# Altium project esp8266.PrjPcb
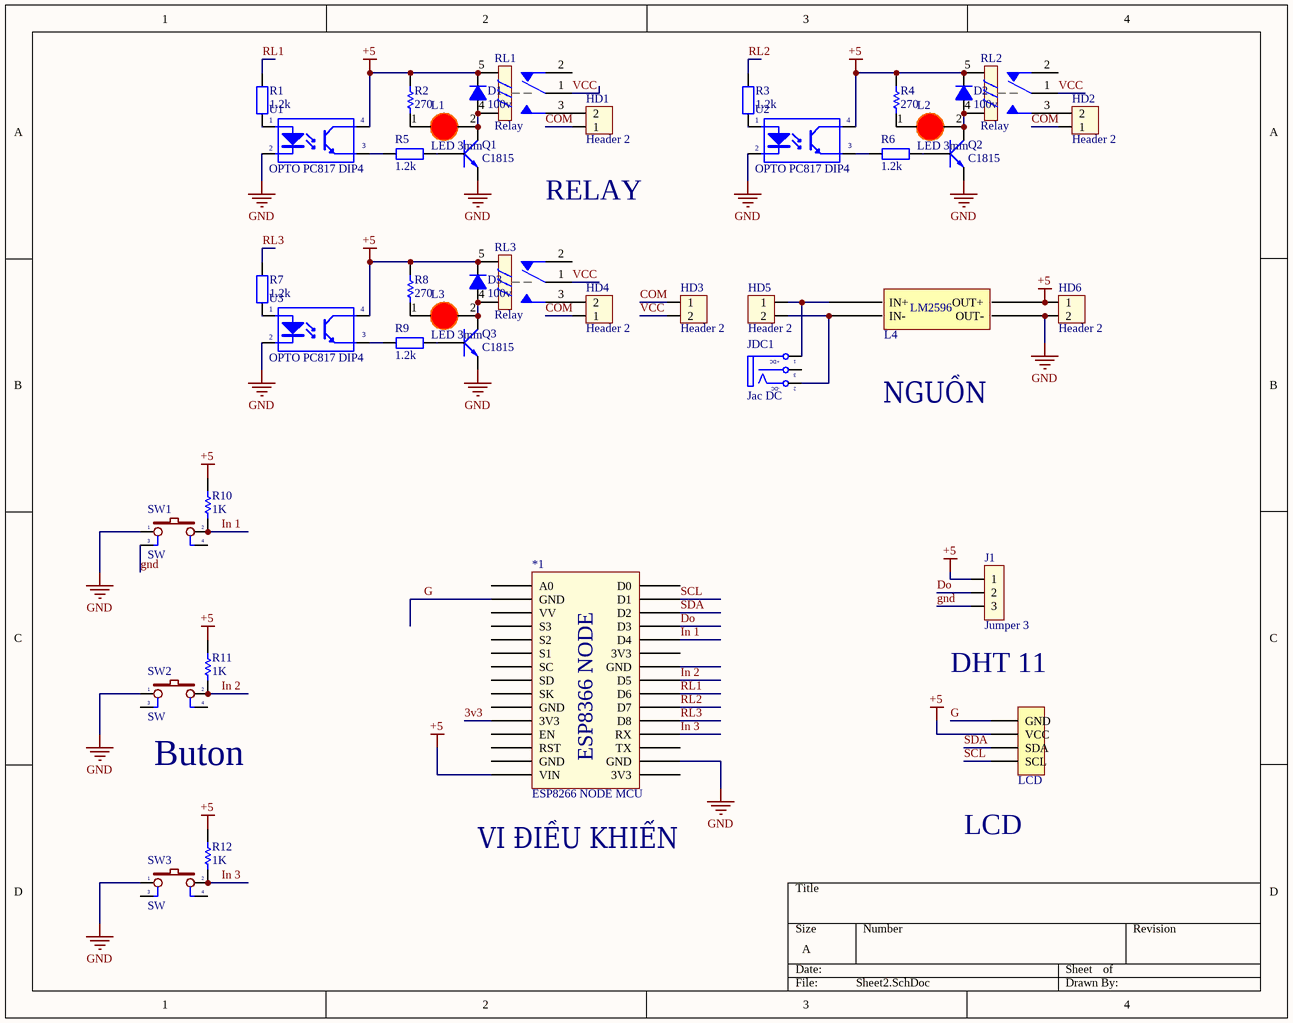
[diagram p0: Sheet2.SchDoc]
1 sheet, 41 parts. Net scope: global (net labels, ports and power ports of the same name join across sheets).
Board file: PCB1.PcbDoc

## Sheet Sheet2.SchDoc
size A

### Parts
*1  ESP8266 NODE MCU  [ESP8266 NODE MCU]
D1  100v  [DIODE 1A]
D2  100v  [DIODE 1A]
D3  100v  [DIODE 1A]
H1  LCD  [XH2.54M-4]
HD1  Header 2  [HED2]
HD2  Header 2  [HED2]
HD3  Header 2  [HED2]
HD4  Header 2  [HED2]
HD5  Header 2  [HED2]
HD6  Header 2  [HED2]
J1  Jumper 3  [JP3]
JDC1  Jac DC  [DC-IN]
L1  LED 3mm  [LED-3MM-RED]
L2  LED 3mm  [LED-3MM-RED]
L3  LED 3mm  [LED-3MM-RED]
L4  BUCK_LM2596  [BUCK_LM2596]  (value not drawn)
Q1  C1815  [TO92]
Q2  C1815  [TO92]
Q3  C1815  [TO92]
R1  1.2k  [tro vach 1/4w]
R2  value 270  [R1/4W1]  (hidden comment: Res1)
R3  1.2k  [tro vach 1/4w]
R4  value 270  [R1/4W1]  (hidden comment: Res1)
R5  1.2k  [tro vach 1/4w]
R6  1.2k  [tro vach 1/4w]
R7  1.2k  [tro vach 1/4w]
R8  value 270  [R1/4W1]  (hidden comment: Res1)
R9  1.2k  [tro vach 1/4w]
R10  value 1K  [R1/4W]  (hidden comment: Res1)
R11  value 1K  [R1/4W]  (hidden comment: Res1)
R12  value 1K  [R1/4W]  (hidden comment: Res1)
RL1  Relay  [Relay 5 Chan SRD]
RL2  Relay  [Relay 5 Chan SRD]
RL3  Relay  [Relay 5 Chan SRD]
SW1  SW  [SW4B]
SW2  SW  [SW4B]
SW3  SW  [SW4B]
U1  OPTO PC817 DIP4  [DIP4]
U2  OPTO PC817 DIP4  [DIP4]
U3  OPTO PC817 DIP4  [DIP4]

### Nets
+5: *1.15(VIN) D1.2(K) D2.2(K) D3.2(K) H1.2(VCC) HD6.1 J1.1 L4.4(OUT+) R2.2 R4.2 R8.2 R10.2 R11.2 R12.2 RL1.5 RL2.5 RL3.5 U1.4(C) U2.4(C) U3.4(C)
gnd: *1.17(GND) HD6.2 J1.3 L4.3(OUT-) Q1.1(E) Q2.1(E) Q3.1(E) SW1.1 SW1.3 SW2.1 SW3.1 U1.2(K) U2.2(K) U3.2(K)
3v3: *1.11(3V3)
COM: HD1.1 HD2.1 HD3.1 HD4.1
Do: *1.27(D3) J1.2
G: *1.2(GND) H1.1(GND)
In 1: *1.26(D4) R10.1 SW1.2
In 2: *1.23(D5) R11.1 SW2.2
In 3: *1.19(RX) R12.1 SW3.2
RL1: *1.22(D6) R1.1
RL2: *1.21(D7) R3.1
RL3: *1.20(D8) R7.1
SCL: *1.29(D1) H1.4(SCL)
SDA: *1.28(D2) H1.3(SDA)
VCC: HD3.2 RL1.1 RL2.1 RL3.1
NetD1_1: D1.1(A) L1.2(K) Q1.2(C) RL1.4
NetD2_1: D2.1(A) L2.2(K) Q2.2(C) RL2.4
NetD3_1: D3.1(A) L3.2(K) Q3.2(C) RL3.4
NetHD1_2: HD1.2 RL1.3
NetHD2_2: HD2.2 RL2.3
NetHD4_2: HD4.2 RL3.3
NetHD5_1: HD5.1 JDC1.1(T) L4.1(IN+)
NetHD5_2: HD5.2 JDC1.2(TN) L4.2(IN-)
NetL1_1: L1.1(A) R2.1
NetL2_1: L2.1(A) R4.1
NetL3_1: L3.1(A) R8.1
NetQ1_3: Q1.3(B) R5.1
NetQ2_3: Q2.3(B) R6.1
NetQ3_3: Q3.3(B) R9.1
NetR1_2: R1.2 U1.1(A)
NetR3_2: R3.2 U2.1(A)
NetR5_2: R5.2 U1.3(E)
NetR6_2: R6.2 U2.3(E)
NetR7_2: R7.2 U3.1(A)
NetR9_2: R9.2 U3.3(E)

Not connected (* = marked no-connect by the designer): *1 1(A0) 3(VV) 4(S3) 5(S2) 6(S1) 7(SC) 8(SD) 9(SK) 10(GND) 12(EN) 13(RST) 14(GND) 16(3V3) 18(TX) 24(GND) 25(3V3) 30(D0); JDC1 3(S); RL1 2; RL2 2; RL3 2; SW1 4; SW2 3 4; SW3 3 4

### Notes on the sheet
- RELAY
- NGUỒN
- DHT 11
- (near SW2) Buton
- (near H1) LCD
- (near *1) VI ĐIỀU KHIỂN
- (in symbol BUCK_LM2596) LM2596
- (in symbol DCIN) +DC; -DC
- (in symbol ESP8266 NODE MCU) ESP8366 NODE

### Library data of the parts
D1-D3 = Diode 1N4007: Cắm; Ten_Linh_Kien: Diode 1N4007 1A (DIP); Don_Vi: Con; Ma_Hang: MH001063; Ghi Chu: *; Kieu_Chan: *; Chung_Loai: Cắm
H1 = Header 4P 2.54 Duc Thang: Cắm; Ten_Linh_Kien: Header 4P XH2.54-4P Đực Thẳng; Don_Vi: Con; Ma_Hang: MH001285; Chung_Loai: Cắm
HD1-HD6 = Header 2: Header 2 (Green); Value: Header 2
J1 = JP3: Value: J3
JDC1 = DCIN: Jac DC input; Value: Jac DC
L1-L3 = LED 3mm Do: Cắm; Don_Vi: Con; Ma_Hang: MH003892; Ten_Linh_Kien: Led 3MM Phủ Đỏ (10c); Ghi_Chu: *; Kieu_Chan: *; Chung_Loai: Cắm
Q1-Q3 = C1815: NPN transistor; Value: C9014
R1 R3 R5-R7 R9 = Tro Vach 1/4W 5% 1.2k: Cắm; Don_Vi: Con; Ten_Linh_Kien: Trở Vạch 1/4w 5% 1.2k; So_Chan: 2; Ma_Hang: MH007348; Chung_Loai: Cắm; Kieu_Chan: *
R2 R4 R8 = Res1_2: Resistor; Manufacturer: Generic Components; Class: Passive; Published: 08/06/2000; Publisher: Altium Hobart Technology Centre; SubClass: Resistor
R10-R12 = Res1_4: Resistor; Manufacturer: Generic Components; Class: Passive; Published: 08/06/2000; Publisher: Altium Hobart Technology Centre; SubClass: Resistor
RL1-RL3 = Relay 5 Chan SRD: Relay 5 Chan; Ma_Hang: MH009374; Ten: Relay 5V10A SRD-05VDC-SL-C Chính Hãng
SW1-SW3 = SW4-1: Switch button 4 pin; Value: SW chip 4 pin
U1-U3 = OPTO PC817 DIP4: Single Opto; Value: PC817